# EAGLE design module (EAGLE 9.4.0)
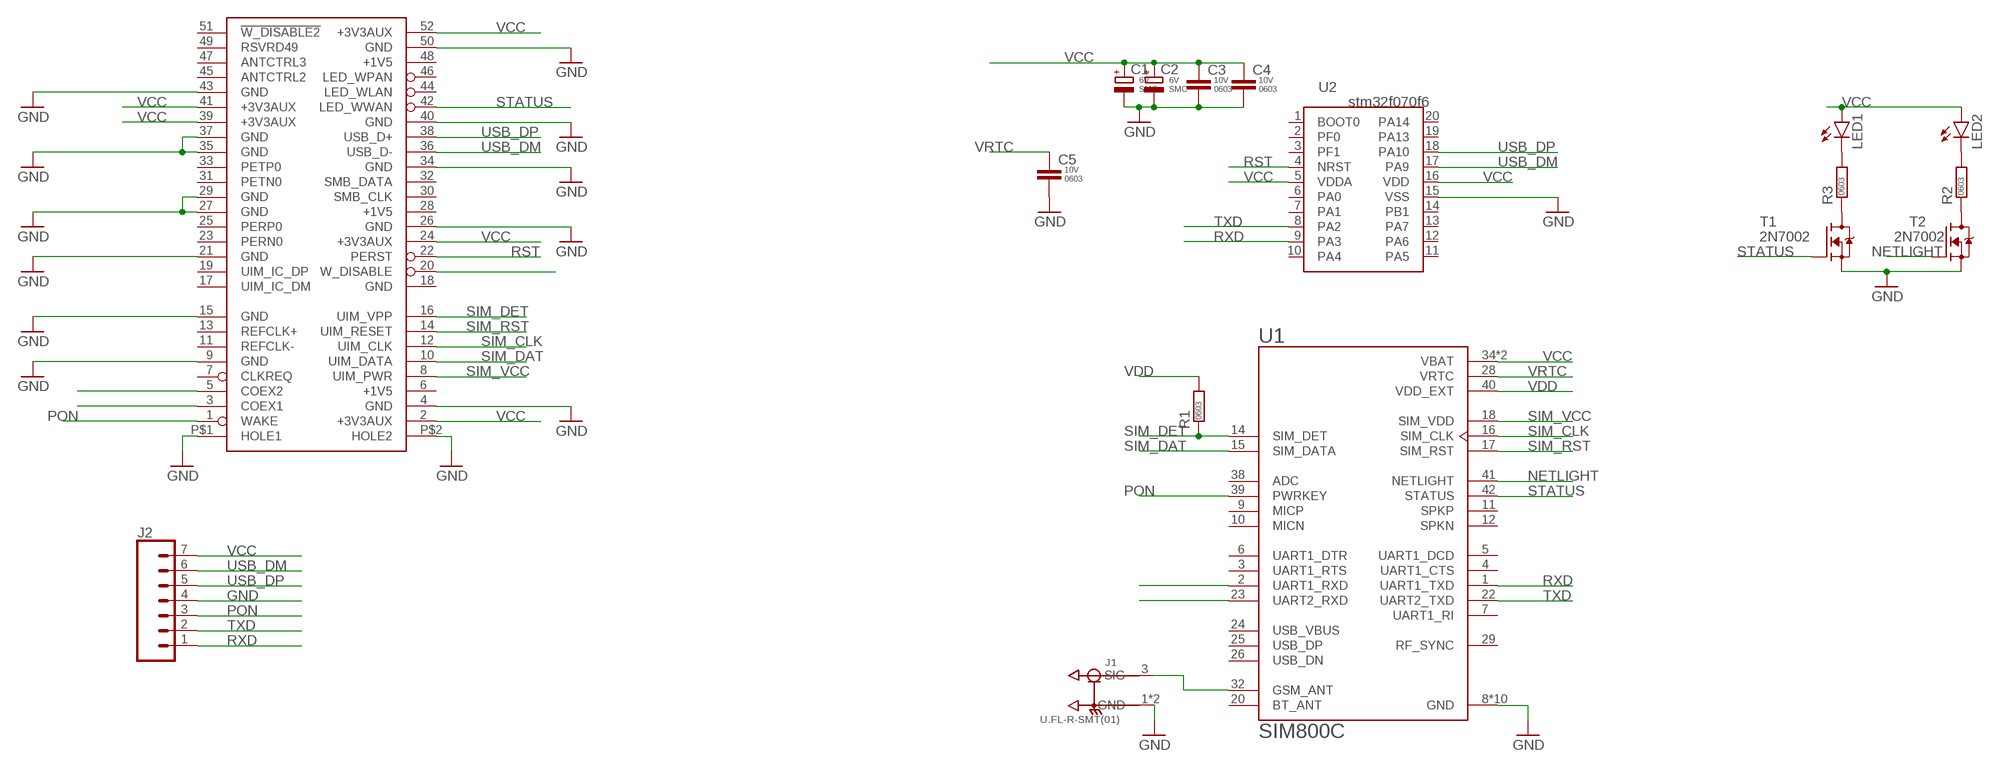
[diagram p0: schematic, sheet 1]

## Parts
C1  CAP-POL-SMC  [SMC_C]
C2  CAP-POL-SMC  [SMC_C]
C3  CAP-0603  [C0603]
C4  CAP-0603  [C0603]
C5  CAP-0603  [C0603]
FORM1  MPCIE_HALF  [MPCIE_HALF]
J1  U.FL-R-SMT(01)  [HRS_U.FL-R-SMT(01)]
J2  CONN_07  [1X07]
LED1  LEDCHIP-LED0603  [CHIP-LED0603]
LED2  LEDCHIP-LED0603  [CHIP-LED0603]
R1  RES-0603  [R0603]
R2  RES-0603  [R0603]
R3  RES-0603  [R0603]
T1  2N7002  [SOT95P240X110-3]
T2  2N7002  [SOT95P240X110-3]
U1  SIM800C  [LCC110P1570X1760X250-42N]
U2  STM32F070F6  [SOP65P640X120-20]

## Nets
GND: C1.- C2.- C3.2 C4.2 C5.2 FORM1.4(GND) FORM1.9(GND) FORM1.15(GND) FORM1.21(GND) FORM1.26(GND) FORM1.27(GND) FORM1.29(GND) FORM1.34(GND) FORM1.35(GND) FORM1.37(GND) FORM1.40(GND) FORM1.43(GND) FORM1.50(GND) FORM1.P$1(HOLE1) FORM1.P$2(HOLE2) J1.1(GND) J1.2(GND) J2.4 T1.2(S) T2.2(S) U1.8(GND) U1.13(GND) U1.19(GND) U1.21(GND) U1.27(GND) U1.30(GND) U1.31(GND) U1.33(GND) U1.36(GND) U1.37(GND) U2.15(VSS)
N$1: J1.3(SIG) U1.32(GSM_ANT)
N$4: LED2.C R2.2
N$5: LED1.C R3.2
N$6: R3.1 T1.3(D)
N$7: R2.1 T2.3(D)
N$9: FORM1.3(COEX1)
N$13: FORM1.5(COEX2)
N$14: U1.2(UART1_RXD)
N$15: U1.23(UART2_RXD)
N$18: FORM1.20(W_DISABLE)
NETLIGHT: T2.1(G) U1.41(NETLIGHT)
PON: FORM1.1(WAKE) J2.3 U1.39(PWRKEY)
RST: FORM1.22(PERST) U2.4(NRST)
RXD: J2.1 U1.1(UART1_TXD) U2.9(PA3)
SIM_CLK: FORM1.12(UIM_CLK) U1.16(SIM_CLK)
SIM_DAT: FORM1.10(UIM_DATA) U1.15(SIM_DATA)
SIM_DET: FORM1.16(UIM_VPP) R1.1 U1.14(SIM_DET)
SIM_RST: FORM1.14(UIM_RESET) U1.17(SIM_RST)
SIM_VCC: FORM1.8(UIM_PWR) U1.18(SIM_VDD)
STATUS: FORM1.42(LED_WWAN) T1.1(G) U1.42(STATUS)
TXD: J2.2 U1.22(UART2_TXD) U2.8(PA2)
USB_DM: FORM1.36(USB_D-) J2.6 U2.17(PA9)
USB_DP: FORM1.38(USB_D+) J2.5 U2.18(PA10)
VCC: C1.+ C2.+ C3.1 C4.1 FORM1.2(+3V3AUX) FORM1.24(+3V3AUX) FORM1.39(+3V3AUX) FORM1.41(+3V3AUX) FORM1.52(+3V3AUX) J2.7 LED1.A LED2.A U1.34(VBAT) U1.35(VBAT) U2.5(VDDA) U2.16(VDD)
VDD: R1.2 U1.40(VDD_EXT)
VRTC: C5.1 U1.28(VRTC)
Unconnected: FORM1.7(CLKREQ) FORM1.11(REFCLK-) FORM1.13(REFCLK+) FORM1.17(UIM_IC_DM) FORM1.19(UIM_IC_DP) FORM1.23(PERN0) FORM1.25(PERP0) FORM1.30(SMB_CLK) FORM1.31(PETN0) FORM1.33(PETP0) FORM1.44(LED_WLAN) FORM1.45(ANTCTRL2) FORM1.46(LED_WPAN) FORM1.47(ANTCTRL3) FORM1.48(+1V5) FORM1.49(RSVRD49) FORM1.51(!W_DISABLE2) U1.3(UART1_RTS) U1.4(UART1_CTS) U1.5(UART1_DCD) U1.6(UART1_DTR) U1.7(UART1_RI) U1.9(MICP) U1.10(MICN) U1.11(SPKP) U1.12(SPKN) U1.20(BT_ANT) U1.24(USB_VBUS) U1.25(USB_DP) U1.26(USB_DN) U1.29(RF_SYNC) U1.38(ADC) U2.1(BOOT0) U2.2(PF0) U2.3(PF1) U2.6(PA0) U2.7(PA1) U2.10(PA4) U2.11(PA5) U2.12(PA6) U2.13(PA7) U2.14(PB1) U2.19(PA13) U2.20(PA14)

## Power pins joined to a net without a drawn wire
+1V5: FORM1.6(+1V5) FORM1.28(+1V5)
GND: FORM1.18(GND)
SMB_DATA: FORM1.32(SMB_DATA)

## Library data of the parts
C1 C2 = parts-passives:CAP-POL-; PACKAGE: SMC; RATING: 6V
C3-C5 = parts-passives:CAP-; PACKAGE: 0603; RATING: 10V
FORM1 = parts-pci:MPCIE_HALF
J1 = parts-molex:U.FL-R-SMT(01): U.FL Series 6 Ghz 50 Ohm Ultra-small SMT Coaxial Cable Receptacle; AVAILABILITY: Unavailable; DESCRIPTION: U.FL Series 6 Ghz 50 Ohm Ultra-small SMT Coaxial Cable Receptacle; MF: Hirose; MP: U.FL-R-SMT_01_; PACKAGE: None; PRICE: None
J2 = SparkFun-Connectors:CONN_07: Multi connection point. Often used as Generic Header-pin footprint for 0.1 inch spaced/style header connections On any of the 0.1 inch spaced packages, you can populate with these: Break Away Headers - Straight <https://www.sparkfun.com/products/116> (PRT-00116) Break Away Male Headers - Right Angle <https://www.sparkfun.com/products/553> (PRT-00553) Female Headers <https://www.sparkfun.com/products/115> (PRT-00115) Break Away Headers - Machine Pin <https://www.sparkfun.com/products/117> (PRT-00117) Break Away Female Headers - Swiss Machine Pin <https://www.sparkfun.com/products/743> (PRT-00743) For SCREWTERMINALS and SPRING TERMINALS visit here: Screw Terimnals on SparkFun.com <https://www.sparkfun.com/search/results?term=Screw+Terminals> (5mm/3.5mm/2.54mm spacing) This device is also useful as a general connection point to wire up your design to another part of your project. Our various solder wires solder well into these plated through hole pads. Hook-Up Wire - Assortment (Stranded, 22 AWG) <https://www.sparkfun.com/products/11375> (PRT-11375) Hook-Up Wire - Assortment (Solid Core, 22 AWG) <https://www.sparkfun.com/products/11367> (PRT-11367) View the entire wire category on our website here <https://www.sparkfun.com/categories/141> Special notes: Molex polarized connector foot print use with SKU : PRT-08231 with associated crimp pins and housings. 1MM SMD Version SKU: PRT-10208 NOTES ON THE VARIANTS LOCK and LOCK_LONGPADS... This footprint was designed to help hold the alignment of a through-hole component (i.e. 6-pin header) while soldering it into place. You may notice that each hole has been shifted either up or down by 0.005 of an inch from it's more standard position (which is a perfectly straight line). This slight alteration caused the pins (the squares in the middle) to touch the edges of the holes. Because they are alternating, it causes a "brace" to hold the component in place. 0.005 has proven to be the perfect amount of "off-center" position when using our standard breakaway headers. Although looks a little odd when you look at the bare footprint, once you have a header in there, the alteration is very hard to notice. Also,if you push a header all the way into place, it is covered up entirely on the bottom side.
LED1 LED2 = led:LED: LED OSRAM: - CHIPLED LG R971, LG N971, LY N971, LG Q971, LY Q971, LO R971, LY R971 LH N974, LH R974 LS Q976, LO Q976, LY Q976 LO Q996 - Hyper CHIPLED LW Q18S LB Q993, LB Q99A, LB R99A - SideLED LS A670, LO A670, LY A670, LG A670, LP A670 LB A673, LV A673, LT A673, LW A673 LH A674 LY A675 LS A676, LA A676, LO A676, LY A676, LW A676 LS A679, LY A679, LG A679 - Hyper Micro SIDELED® LS Y876, LA Y876, LO Y876, LY Y876 LT Y87S - SmartLED LW L88C, LW L88S LB L89C, LB L89S, LG L890 LS L89K, LO L89K, LY L89K LS L896, LA L896, LO L896, LY L896 - TOPLED LS T670, LO T670, LY T670, LG T670, LP T670 LSG T670, LSP T670, LSY T670, LOP T670, LYG T670 LG T671, LOG T671, LSG T671 LB T673, LV T673, LT T673, LW T673 LH T674 LS T676, LA T676, LO T676, LY T676, LB T676, LH T676, LSB T676, LW T676 LB T67C, LV T67C, LT T67C, LS T67K, LO T67K, LY T67K, LW E67C LS E67B, LA E67B, LO E67B, LY E67B, LB E67C, LV E67C, LT E67C LW T67C LS T679, LY T679, LG T679 LS T770, LO T770, LY T770, LG T770, LP T770 LB T773, LV T773, LT T773, LW T773 LH T774 LS E675, LA E675, LY E675, LS T675 LS T776, LA T776, LO T776, LY T776, LB T776 LHGB T686 LT T68C, LB T68C - Hyper Mini TOPLED® LB M676 - Mini TOPLED Santana® LG M470 LS M47K, LO M47K, LY M47K Source: http://www.osram.convergy.de LUXEON: - LUMILED® LXK2-PW12-R00, LXK2-PW12-S00, LXK2-PW14-U00, LXK2-PW14-V00 LXK2-PM12-R00, LXK2-PM12-S00, LXK2-PM14-U00 LXK2-PE12-Q00, LXK2-PE12-R00, LXK2-PE12-S00, LXK2-PE14-T00, LXK2-PE14-U00 LXK2-PB12-K00, LXK2-PB12-L00, LXK2-PB12-M00, LXK2-PB14-N00, LXK2-PB14-P00, LXK2-PB14-Q00 LXK2-PR12-L00, LXK2-PR12-M00, LXK2-PR14-Q00, LXK2-PR14-R00 LXK2-PD12-Q00, LXK2-PD12-R00, LXK2-PD12-S00 LXK2-PH12-R00, LXK2-PH12-S00 LXK2-PL12-P00, LXK2-PL12-Q00, LXK2-PL12-R00 Source: www.luxeon.com KINGBRIGHT: KA-3528ASYC Source: www.kingbright.com
R1-R3 = parts-passives:RES-; PACKAGE: 0603
T1 T2 = parts-onsemi:2N7002
U1 = parts-simcom:SIM800C: Module: GSM/Bluetooth; GPRS; 2G; 1800MHz, 900MHz; 85.6kbps; SMD; AVAILABILITY: Unavailable; DESCRIPTION: Module: GSM/Bluetooth; GPRS; 2G; 1800MHz, 900MHz; 85.6kbps; SMD; MF: Simcom; MP: SIM800C; PACKAGE: None; PRICE: None
U2 = parts-st:STM32F070F6

## Board
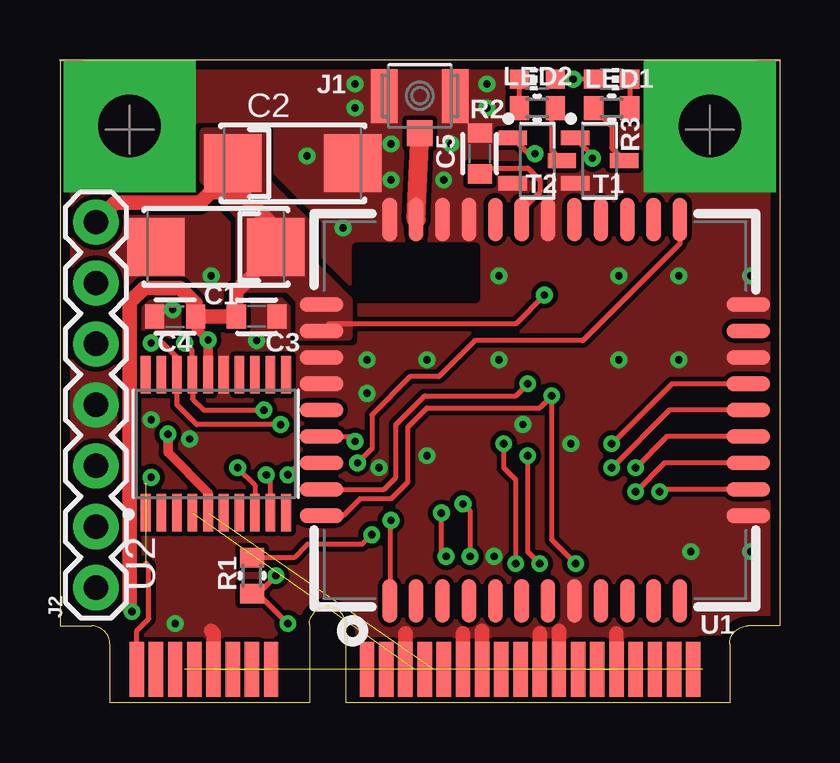
[diagram p1: board, top side]
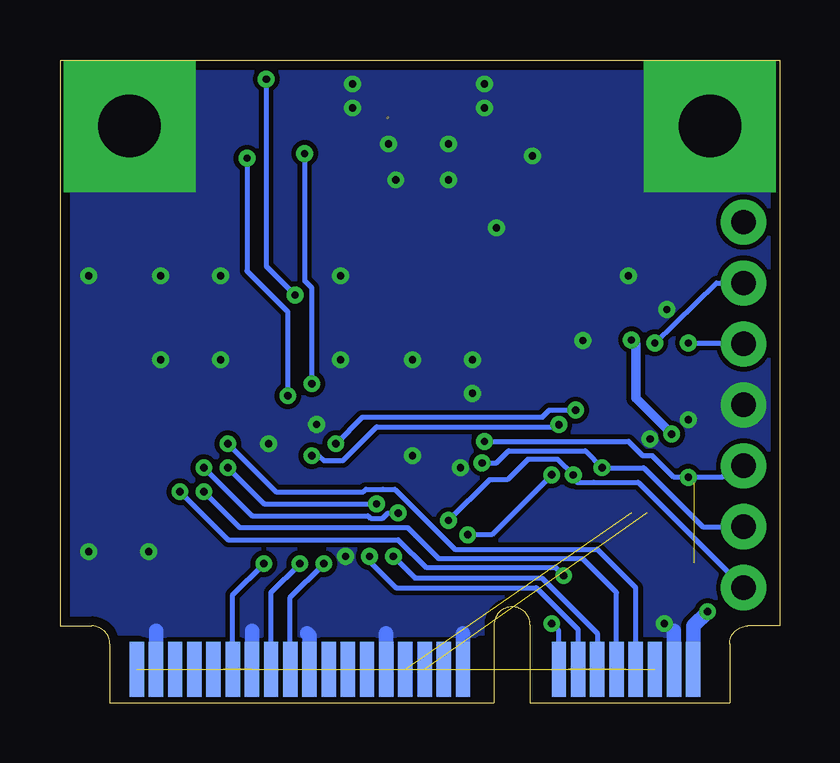
[diagram p2: board, bottom side, seen from below]

Size 30 x 26.8 mm. Coordinates in mm from the lower left corner, seen from the top.
Copper layers (1*16): Top 0.035mm / dielectric 0.9mm / Bottom 0.035mm
Design rules "default *": minimum track width 6mil, minimum drill 0.3mm, track to track 6mil, track to pad 6mil, pad to pad 6mil, via to via 6mil, smd to smd 6mil, copper to edge 0.4mm, drill to drill 6mil, minimum pad ring 10mil, minimum via ring 8mil, stop-mask expansion 4mil, vias tented up to drill 0.6mm, thermal gap 10mil

### Footprints (pad centres in the part's own frame; a part is rotated, then mirrored left to right if it is on the bottom)
SMC_C = smd 2.4 x 2.4: + -2.5,0; - 2.5,0
C0603 = smd 0.8 x 1: 1 -0.85,0; 2 0.85,0
MPCIE_HALF = smd 0.6 x 2.3: 1 -11.8,-25.4; 3 -11,-25.4; 5 -10.2,-25.4; 7 -9.4,-25.4; 9 -8.6,-25.4; 11 -7.8,-25.4; 13 -7,-25.4; 15 -6.2,-25.4; 17 -2.2,-25.4; 19 -1.4,-25.4; 21 -0.6,-25.4; 23 0.2,-25.4; 25 1,-25.4; 27 1.8,-25.4; 29 2.6,-25.4; 31 3.4,-25.4; 33 4.2,-25.4; 35 5,-25.4; 37 5.8,-25.4; 39 6.6,-25.4; 41 7.4,-25.4; 43 8.2,-25.4; 45 9,-25.4; 47 9.8,-25.4; 49 10.6,-25.4; 51 11.4,-25.4 | smd 0.6 x 2.3 bottom: 2 -11.4,-25.4; 4 -10.6,-25.4; 6 -9.8,-25.4; 8 -9,-25.4; 10 -8.2,-25.4; 12 -7.4,-25.4; 14 -6.6,-25.4; 16 -5.8,-25.4; 18 -1.8,-25.4; 20 -1,-25.4; 22 -0.2,-25.4; 24 0.6,-25.4; 26 1.4,-25.4; 28 2.2,-25.4; 30 3,-25.4; 32 3.8,-25.4; 34 4.6,-25.4; 36 5.4,-25.4; 38 6.2,-25.4; 40 7,-25.4; 42 7.8,-25.4; 44 8.6,-25.4; 46 9.4,-25.4; 48 10.2,-25.4; 50 11,-25.4; 52 11.8,-25.4 | drill 2.6 pad 5.5 square: P$1 12.1,-2.75; P$2 -12.1,-2.75
HRS_U.FL-R-SMT(01) = smd 1.1 x 2.25: 1 -1.475,0; 2 1.475,0 | smd 1.05 x 1.1: 3 0,-1.55
1X07 = drill 1.016 pad 1.88: 1 0,0; 2 2.54,0; 3 5.08,0; 4 7.62,0; 5 10.16,0; 6 12.7,0; 7 15.24,0
CHIP-LED0603 = smd 0.8 x 0.8: A 0,-0.75; C 0,0.75
R0603 = smd 0.8 x 1: 1 -0.75,0; 2 0.75,0
SOT95P240X110-3 = smd 1.18 x 0.609: 1 -1.024,0.95; 2 -1.024,-0.95; 3 1.024,0
LCC110P1570X1760X250-42N = smd 1.8 x 0.6: 1 -7.95,6.05; 2 -7.95,4.95; 3 -7.95,3.85; 4 -7.95,2.75; 5 -7.95,1.65; 6 -7.95,0.55; 7 -7.95,-0.55; 8 -7.95,-1.65; 9 -7.95,-2.75; 10 -7.95,-3.85; 11 -7.95,-4.95; 12 -7.95,-6.05; 22 7.95,-6.05; 23 7.95,-4.95; 24 7.95,-3.85; 25 7.95,-2.75; 26 7.95,-1.65; 27 7.95,-0.55; 28 7.95,0.55; 29 7.95,1.65; 30 7.95,2.75; 31 7.95,3.85; 32 7.95,4.95; 33 7.95,6.05 | smd 0.6 x 1.8: 13 -4.4,-8.9; 14 -3.3,-8.9; 15 -2.2,-8.9; 16 -1.1,-8.9; 17 0,-8.9; 18 1.1,-8.9; 19 2.2,-8.9; 20 3.3,-8.9; 21 4.4,-8.9; 34 4.4,8.9; 35 3.3,8.9; 36 2.2,8.9; 37 1.1,8.9; 38 0,8.9; 39 -1.1,8.9; 40 -2.2,8.9; 41 -3.3,8.9; 42 -4.4,8.9
SOP65P640X120-20 = smd 1.559 x 0.407: 1 -2.878,2.925; 2 -2.878,2.275; 3 -2.878,1.625; 4 -2.878,0.975; 5 -2.878,0.325; 6 -2.878,-0.325; 7 -2.878,-0.975; 8 -2.878,-1.625; 9 -2.878,-2.275; 10 -2.878,-2.925; 11 2.878,-2.925; 12 2.878,-2.275; 13 2.878,-1.625; 14 2.878,-0.975; 15 2.878,-0.325; 16 2.878,0.325; 17 2.878,0.975; 18 2.878,1.625; 19 2.878,2.275; 20 2.878,2.925

### Placement (x,y rotation side)
C1  6.5,19 180 top
C2  9.7,22.5 0 top
C3  8.2,16.1 0 top
C4  4.8,16.1 180 top
C5  17.5,22.9 90 top
FORM1  15,26.8 0 top
J1  15,25.3 0 top
J2  1.5,4.8 90 top
LED1  23,26 270 top
LED2  19.9,26 90 top
R1  8,5.3 90 top
R2  19.9,24.8 180 top
R3  23,24.8 0 top
T1  22.5,22.6 0 top
T2  19.9,22.6 0 top
U1  19.8,12.2 90 top
U2  6.5,10.8 90 top

### Tracks (layer width: path | path; a pad name or v marks a point on that pad's centre or on a via)
+1V5  (1 unrouted)
GND  (via drill 0.3)  (3 unrouted)
  Top 0.6: FORM1.43 23.2,2.9 | FORM1.37 20.8,3 | FORM1.35 20,2.9 | FORM1.27 16.8,2.9 | FORM1.29 17.6,3 | FORM1.21 14.4,2.9 | FORM1.9 6.4,2.9 6.3,3
  Bottom 0.6: FORM1.4 4.4,3 | FORM1.18 13.2,2.9 | FORM1.26 16.4,2.9 | FORM1.34 19.6,2.8 19.7,2.9 | FORM1.40 22,3 | FORM1.50 26,3
  other vias: 13.8,21.8 13.8,23.3 12.3,24.8 12.3,25.8 17.8,25.8 17.8,24.8 16.3,23.3 16,21.8 28.8,17.8 25.8,17.8 23.3,17.8 18.3,17.8 11.8,19.8 6.3,17.8 10.3,22.8 25.8,14.3 23.3,14.3 18.3,14.3 15.3,14.3 12.8,14.3 21.3,10.8 15.3,10.3 12.8,12.9 28.8,6.3 26.3,6.3 8.2,15.1 19.3,11.6 3.8,11.8 5.4,11 4.7,16.4 4.8,3.3 18.1,6.1 13.3,9.8
  pour Top (isolate 0.2, rank 5, no thermals): -1,2.8 31,2.8 31,27.8 -1,27.8
  pour Bottom (isolate 0.2, no thermals): -1.5,2.8 32,2.8 32,28.8 -1.5,28.8
N$1
  Top 0.8: U1.32 J1.3
N$4
  Top 0.2: R2.2 LED2.C
N$5
  Top 0.2: LED1.C R3.2
N$6
  Top 0.2: R3.1 23,24.05 23,23.12 T1.3
N$7
  Top 0.2: T2.3 20.5,23.02 20.5,24.65 R2.1
NETLIGHT  (via drill 0.3)
  Top 0.2: T2.1 19.53,22.9 v19.8,22.9 | U1.41 13.5,8.9 14,9.4 14,11.6 15.2,12.8 19,12.8 v19.5,13.3
  Bottom 0.2: v19.8,22.9 19.8,17.6 19.5,17.3 v19.5,13.3
PON  (via drill 0.3)  (1 unrouted)
  Top 0.2: v3.81,9.4 3.57,9.17 | U1.39 12.09,11.1 v12.3,10.89 | FORM1.1 3.2,3 3.7,3.5 3.7,5.7 3.57,5.82
  Bottom 0.2: J2.3 1.93,9.88 2.41,9.4 v3.81,9.4 4.4,9.4 5.3,10.3 5.7,10.3 6.3,10.9 v12.29,10.9 v12.3,10.89
RST  (1 unrouted)
RXD  (via drill 0.3)
  Top 0.2: U2.9 8.78,9.32 v8.6,9.49 | v13.8,7.6 13.75,7.55 U1.1
  Bottom 0.2: J2.1 5.89,9.19 7.75,9.19 8.45,9.19 8.6,9.34 v8.6,9.49 9.25,10.15 10.5,10.15 11.35,9.3 12.1,9.3 v13.8,7.6
SIM_CLK  (via drill 0.3)
  Top 0.2: U1.16 25.3,11.1 v24,9.8 | v16.1,6.1 15.9,6.3 v15.9,7.91
  Bottom 0.2: v24,9.8 22,7.8 17.16,7.8 17.05,7.69 16.55,7.69 16.33,7.91 v15.9,7.91 | v16.1,6.1 15.2,5.2 11.1,5.2 9.9,5.2 7.6,2.9 FORM1.12
SIM_DAT  (via drill 0.3)
  Top 0.2: U1.15 25.2,10 v24,8.8
  Bottom 0.2: v24,8.8 22.5,7.3 15.5,7.3 14.2,6 8.2,6 6.8,4.6 FORM1.10
SIM_DET  (via drill 0.3)
  Top 0.2: U1.14 25.1,8.9 v25,8.8 | v9.5,3.3 8.25,4.55 | 8.25,4.55 R1.1 8.25,4.55 | v9,5.3 8.25,4.55
  Bottom 0.2: v25,8.8 23,6.8 15.9,6.8 14.75,5.65 9.35,5.65 v9,5.3 | FORM1.16 9.2,3 v9.5,3.3
SIM_RST  (via drill 0.3)
  Top 0.2: U1.17 25.4,12.2 v23,9.8 | v16.8,8.29 17.1,7.99 v17.1,6.1
  Bottom 0.2: v23,9.8 21.5,8.3 v16.81,8.3 v16.8,8.29 | v17.1,6.1 17.1,5.9 16,4.8 10.14,4.8 8.4,3.06 FORM1.14
SIM_VCC  (via drill 0.3)
  Top 0.2: U1.18 25.5,13.3 v23,10.8
  Bottom 0.2: v23,10.8 21,8.8 17.35,8.8 17.25,8.9 16.55,8.9 16.04,8.9 13.54,6.4 7.6,6.4 6,4.8 FORM1.8
STATUS  (via drill 0.3)
  Top 0.2: T1.1 22.2,22.83 v22.2,22.7 | v21.5,5.8 20.5,6.8 v20.5,12.8 20,12.3 15.3,12.3 14.5,11.5 14.5,9.2 13.8,8.5 12.5,8.5 11.8,7.8 U1.42
  Bottom 0.2: v22.2,22.7 22.2,18 20.5,16.3 v20.5,12.8 | FORM1.42 22.8,4.5 v21.5,5.8
TXD  (via drill 0.3)
  Top 0.2: U1.22 25.85,19.15 21.8,15.1 17.3,15.1 15.8,13.6 14.6,13.6 13,12 13,10.6 v12.4,10 | v7.4,9.8 8.12,9.07 U2.8
  Bottom 0.2: J2.2 3.2,7.34 5.66,9.8 v7.4,9.8 8.1,10.5 11.3,10.5 11.8,10 v12.4,10 12.39,10.01
USB_DM  (via drill 0.3)
  Top 0.2: v8.5,12.2 6,12.2 5.53,12.68 U2.17 5.5,13.7 5.5,14.7 v5.2,15 | v19,5.8 19,9.3 18.5,9.8 v18.5,10.8
  Bottom 0.2: v8.5,12.2 9.6,12.2 9.9,11.9 17.4,11.9 v18.5,10.8 | FORM1.36 20.4,4.4 v19,5.8 | v5.2,15 2.63,17.5 J2.6
USB_DP  (via drill 0.3)
  Top 0.2: v20,5.8 19.5,6.3 v19.5,10.3 | v9.2,11.59 5.71,11.59 4.88,12.43 U2.18 4.88,14.4 4.28,15 v3.8,15
  Bottom 0.2: FORM1.38 21.2,4.6 v20,5.8 | v19.5,10.3 19.2,10.3 19,10.1 18.2,10.1 16.8,11.5 9.49,11.5 9.4,11.59 v9.2,11.59 | v3.8,15 1.54,15 J2.5
VCC  (via drill 0.3)  (4 unrouted)
  Top 0.2: LED2.A v21.4,26 LED1.A | v20.2,17 19,15.8 11.2,15.8 U1.35
  Top 0.4: U2.16 v6.18,15.12 5.65,15.65 C4.1 | v4.5,11.2 4.5,10.43 6.18,8.75 U2.5
  Top 0.6: v3,3.8 2.9,3.9 2.9,16.7 3.5,17.3 5,17.3 5.65,16.65 C4.1 C3.1 7.35,17.15 8,17.8 | J2.7 2.31,20.85 5.84,20.85 6.29,21.3 7.5,21.3 9,19.8 C1.+
  Bottom 0.2: v21.4,26 21.4,18.2 v20.2,17
  Bottom 0.4: v4.5,11.2 6,12.7 6,14.95 v6.18,15.12
  Bottom 0.6: FORM1.2 3.6,3.2 v3,3.8
  pour Top (no thermals): 10,15.3 10,16.8 9.5,17.3 7.5,17.3 7.5,20.3 6,21.8 6,23.8 8.5,23.8 8.5,21.8 10,20.3 10.5,19.8 10.5,18.8 10.5,18.3 12,16.8 12,15.3
VDD  (via drill 0.3)
  Top 0.2: U1.40 9.99,10 v9.5,9.51 | v13,7.01 12.6,6.61 10.31,6.61 9.75,6.05 R1.2
  Bottom 0.2: v9.5,9.51 12,7.01 v13,7.01
VRTC
  Top 0.2: C5.1 17.75,22.3 19.5,22.3 20,21.8 20,21.3 19.25,20.55 U1.28